# Altium schematic sheet LoraSTM32_2v2.SchDoc
size 420 x 297 mm; Organization: Altium Limited; Address1: L3, 12a Rodborough Rd; Address2: Frenchs Forest; Address3: NSW; Address4: Australia 2086; Scale: 1:1; Разраб.: Иванов; Обозначение документа: АБВГ.123456.001 Э3; Пров.: Петров; Утв.: Сидоров; Наименование организации: ОАО "Ваша фирма"; Перв. применение: АБВГ.123456.000; Наименование изделия 1: Плата; Наименование изделия 2: Схема электрическая; Наименование изделия 3: принципиальная; Нач. отд.: Нач. отд.; Фамилия нач. отд.: Сидоров
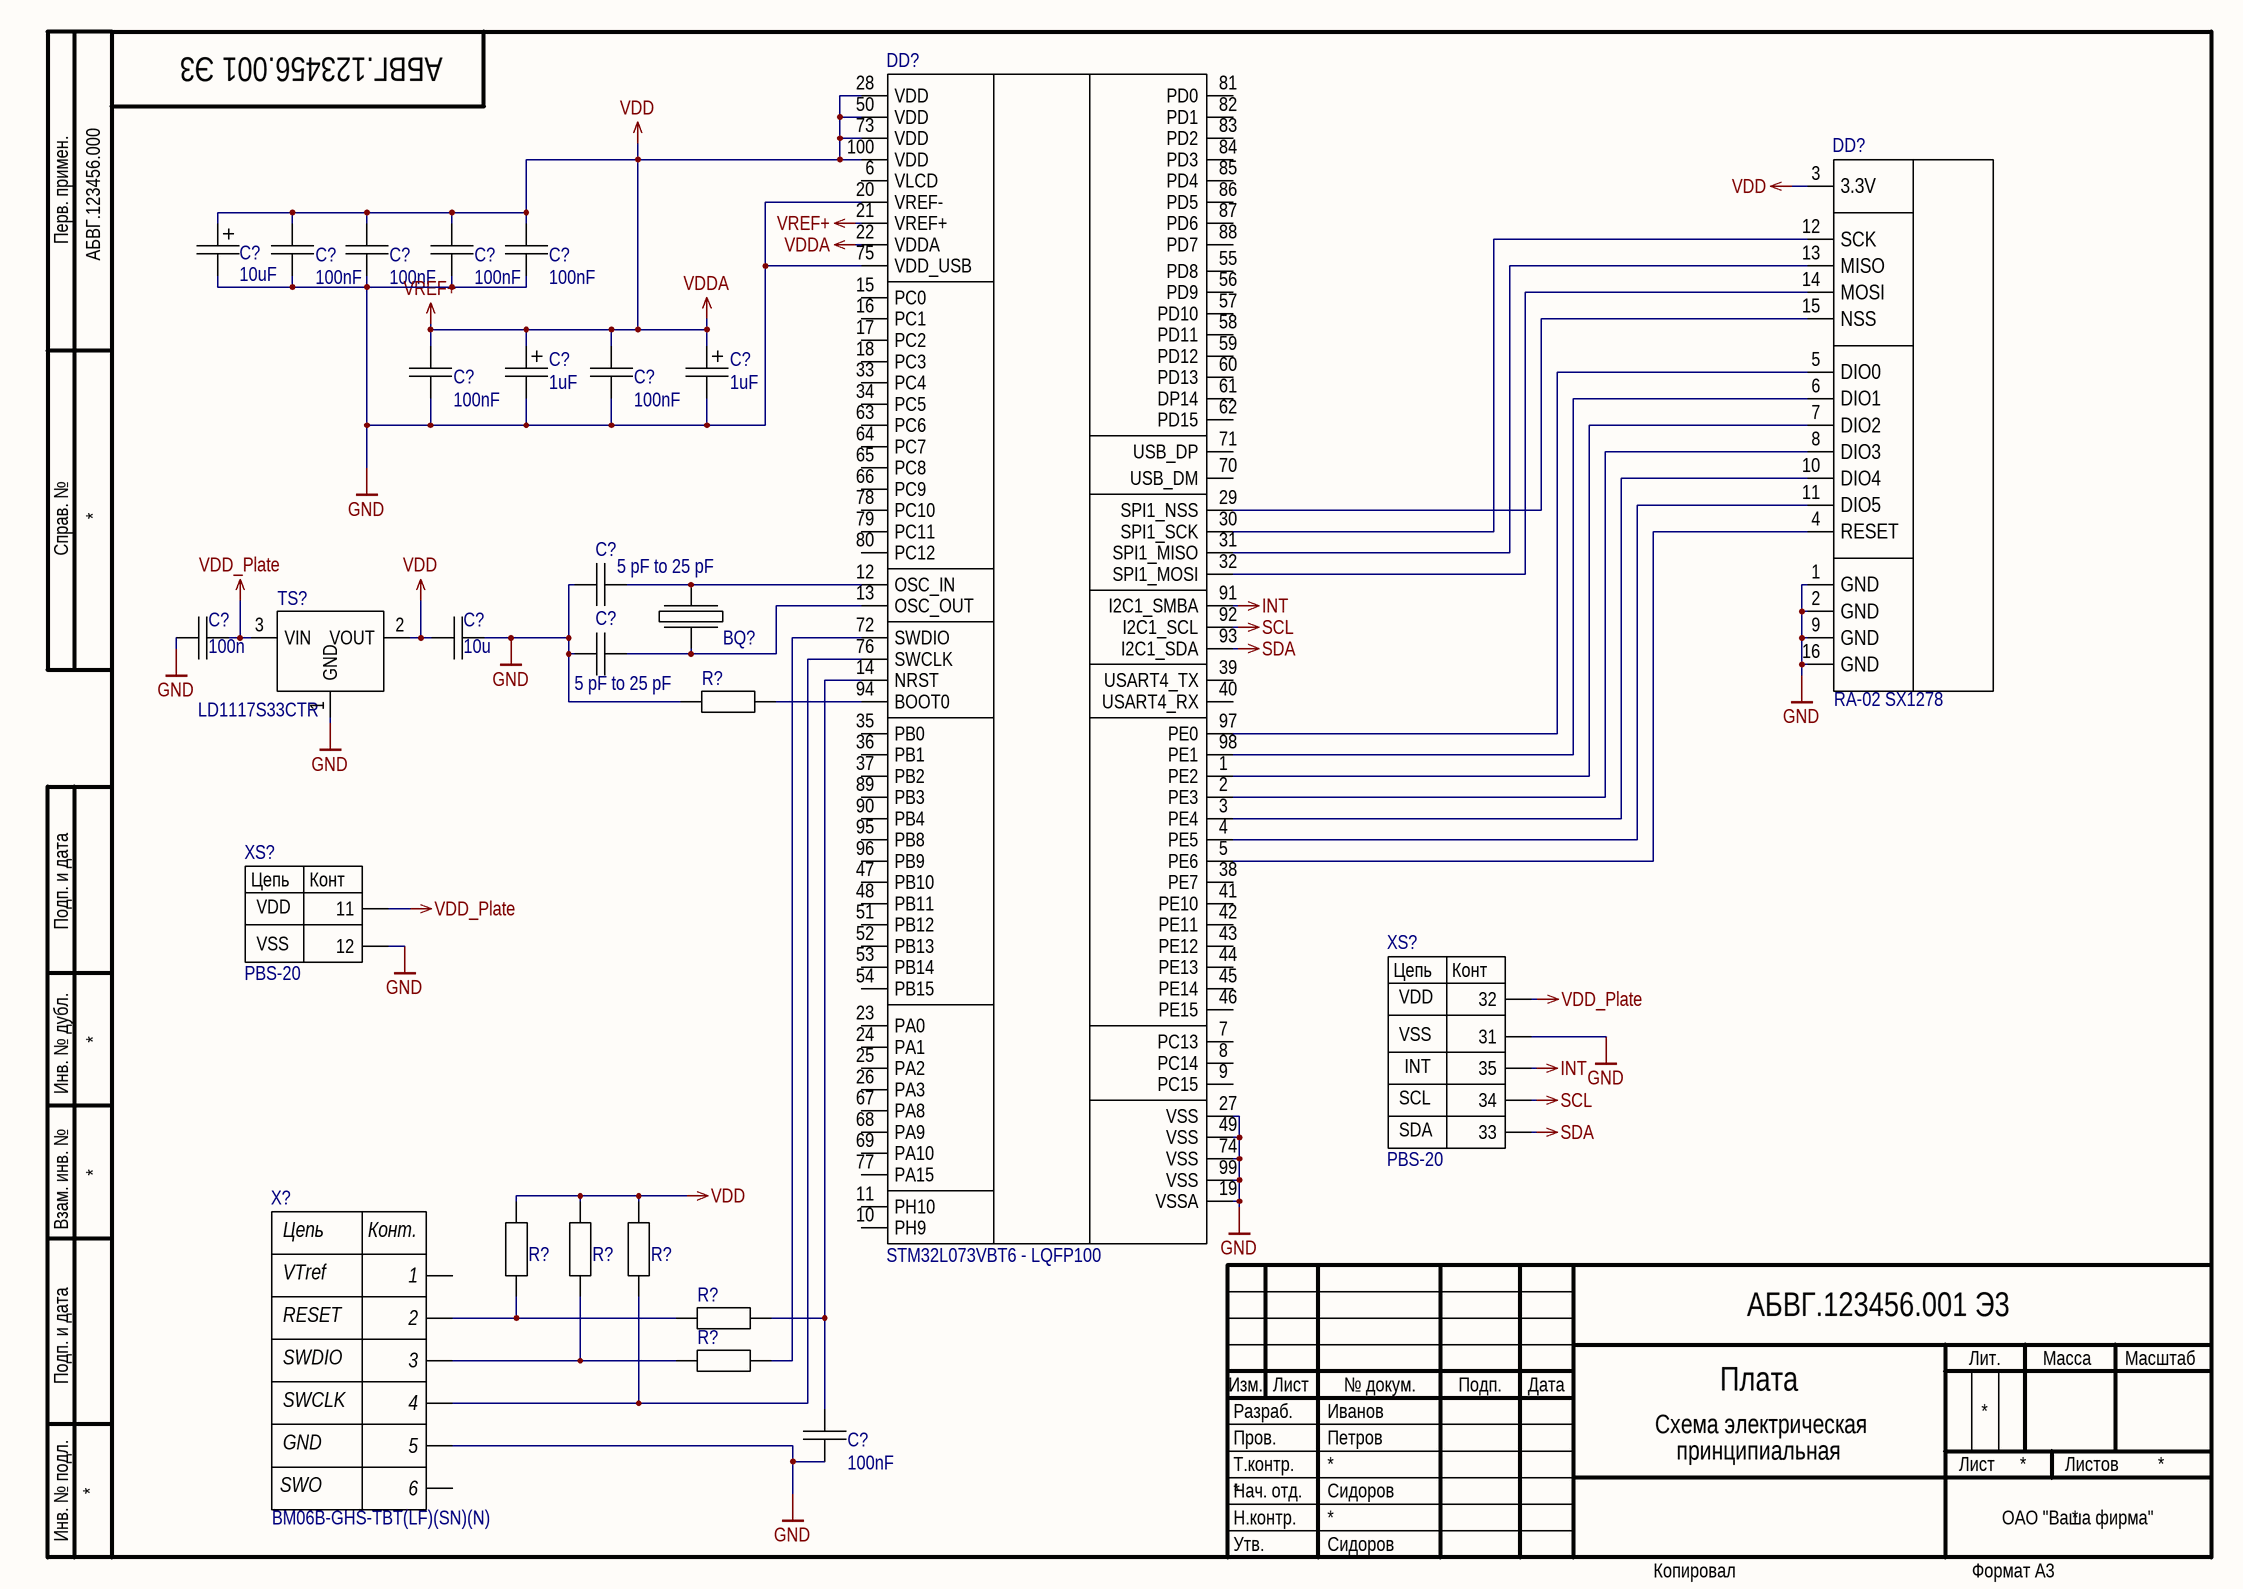
[diagram p0: LoraSTM32_2v2.SchDoc]

## Parts
(Parts that share a designator on the sheet are numbered #1, #2 ... from top to bottom, then left to right.)
BQ?  ABM8G-12.000MHZ-4Y-T3  [ABM8G]  (value not drawn)
C?#1  value 10uF  [CAPMP3216X16N-A]  (hidden comment: *)
C?#2  value 100nF  [CAPC0603X02N]  (hidden comment: CC0603)
C?#3  value 100nF  [CAPC0603X02N]  (hidden comment: CC0603)
C?#4  value 100nF  [CAPC0603X02N]  (hidden comment: CC0603)
C?#5  value 100nF  [CAPC0603X02N]  (hidden comment: CC0603)
C?#6  value 100nF  [CAPC0603X02N]  (hidden comment: CC0603)
C?#7  value 1uF  [CAPMP3216X16N-A]  (hidden comment: *)
C?#8  value 100nF  [CAPC0603X02N]  (hidden comment: CC0603)
C?#9  value 1uF  [CAPMP3216X16N-A]  (hidden comment: *)
C?#10  value 5 pF to 25 pF  [CAPC0603X02N]  (hidden comment: CC0603)
C?#11  GRM21BR71C105KA01L: 100n  [Murata_GRM121_IPC_B]  (hidden comment: *)
C?#12  GRM21BR71C105KA01L: 10u  [Murata_GRM121_IPC_B]  (hidden comment: *)
C?#13  value 5 pF to 25 pF  [CAPC0603X02N]  (hidden comment: CC0603)
C?#14  value 100nF  [CAPC0603X02N]  (hidden comment: CC0603)
DD?#1  STM32L073VBT6 - LQFP100  [*QFP50P1600X1600X170-100N]
DD?#2  RA-02 SX1278  [RA-02]
R?#1  R1608  [RESC1608X05N]  (value not drawn)
R?#2  R1608  [RESC1608X05N]  (value not drawn)
R?#3  R1608  [RESC1608X05N]  (value not drawn)
R?#4  R1608  [RESC1608X05N]  (value not drawn)
R?#5  R1608  [RESC1608X05N]  (value not drawn)
R?#6  R1608  [RESC1608X05N]  (value not drawn)
TS?  LD1117S33CTR  [SOT-23-TT3_M]
X?  BM06B-GHS-TBT(LF)(SN)(N)  [BM06B-GH]
XS?#1  PBS-20  [PBS-20 - 13]
XS?#2  PBS-20  [PBS-20]

## Nets
GND: C?#1.2 C?#2.2 C?#3.2 C?#4.2 C?#5.2 C?#6.2 C?#7.2 C?#8.2 C?#9.2 C?#10.1 C?#11.2 C?#12.1 C?#13.1 C?#14.2 DD?#1.19(VSSA) DD?#1.20(VREF-) DD?#1.27(VSS) DD?#1.49(VSS) DD?#1.74(VSS) DD?#1.75(VDD_USB) DD?#1.99(VSS) DD?#2.1(GND) DD?#2.2(GND) DD?#2.9(GND) DD?#2.16(GND) R?#1.2 TS?.1(GND) X?.5 XS?#1.12 XS?#2.10(31)
INT: DD?#1.91(I2C1_SMBA) XS?#2.6(35)
SCL: DD?#1.92(I2C1_SCL) XS?#2.7(34)
SDA: DD?#1.93(I2C1_SDA) XS?#2.8(33)
VDD: C?#1.1 C?#2.1 C?#3.1 C?#4.1 C?#5.1 C?#6.1 C?#7.1 C?#8.1 C?#9.1 C?#12.2 DD?#1.21(VREF+) DD?#1.22(VDDA) DD?#1.28(VDD) DD?#1.50(VDD) DD?#1.73(VDD) DD?#1.100(VDD) DD?#2.3(3.3V) R?#2.1 R?#3.1 R?#4.1 TS?.2(VOUT)  [also labelled VDDA, VREF+]
VDD_Plate: C?#11.1 TS?.3(VIN) XS?#1.11 XS?#2.9(32)
NetBQ?_1: BQ?.1 C?#13.2 DD?#1.13(OSC_OUT)
NetBQ?_3: BQ?.3 C?#10.2 DD?#1.12(OSC_IN)
NetC?#14_1: C?#14.1 DD?#1.14(NRST) R?#5.1
NetDD?#1_1: DD?#1.1(PE2) DD?#2.7(DIO2)
NetDD?#1_2: DD?#1.2(PE3) DD?#2.8(DIO3)
NetDD?#1_3: DD?#1.3(PE4) DD?#2.10(DIO4)
NetDD?#1_4: DD?#1.4(PE5) DD?#2.11(DIO5)
NetDD?#1_5: DD?#1.5(PE6) DD?#2.4(RESET)
NetDD?#1_29: DD?#1.29(SPI1_NSS) DD?#2.15(NSS)
NetDD?#1_30: DD?#1.30(SPI1_SCK) DD?#2.12(SCK)
NetDD?#1_31: DD?#1.31(SPI1_MISO) DD?#2.13(MISO)
NetDD?#1_32: DD?#1.32(SPI1_MOSI) DD?#2.14(MOSI)
NetDD?#1_72: DD?#1.72(SWDIO) R?#6.1
NetDD?#1_76: DD?#1.76(SWCLK) R?#4.2 X?.4
NetDD?#1_94: DD?#1.94(BOOT0) R?#1.1
NetDD?#1_97: DD?#1.97(PE0) DD?#2.5(DIO0)
NetDD?#1_98: DD?#1.98(PE1) DD?#2.6(DIO1)
NetR?#2_2: R?#2.2 R?#5.2 X?.2
NetR?#3_2: R?#3.2 R?#6.2 X?.3

Not connected (* = marked no-connect by the designer): DD?#1 6(VLCD) 7(PC13) 8(PC14) 9(PC15) 10(PH9) 11(PH10) 15(PC0) 16(PC1) 17(PC2) 18(PC3) 23(PA0) 24(PA1) 25(PA2) 26(PA3) 33(PC4) 34(PC5) 35(PB0) 36(PB1) 37(PB2) 38(PE7) 39(USART4_TX) 40(USART4_RX) 41(PE10) 42(PE11) 43(PE12) 44(PE13) 45(PE14) 46(PE15) 47(PB10) 48(PB11) 51(PB12) 52(PB13) 53(PB14) 54(PB15) 55(PD8) 56(PD9) 57(PD10) 58(PD11) 59(PD12) 60(PD13) 61(DP14) 62(PD15) 63(PC6) 64(PC7) 65(PC8) 66(PC9) 67(PA8) 68(PA9) 69(PA10) 70(USB_DM) 71(USB_DP) 77(PA15) 78(PC10) 79(PC11) 80(PC12) 81(PD0) 82(PD1) 83(PD2) 84(PD3) 85(PD4) 86(PD5) 87(PD6) 88(PD7) 89(PB3) 90(PB4) 95(PB8) 96(PB9); X? 1 6

## Notes on the sheet
- Перв. примен.
- Справ. №
- Подп. и дата
- Инв. № дубл.
- Взам. инв. №
- Разраб.
- Изм.
- Лист
- № докум.
- Подп.
- Дата
- Лит.
- Масса
- Масштаб
- Пров.
- Т.контр.
- Листов
- Инв. № подл.
- Утв.
- Н.контр.
- Копировал
- Формат А3
- (in symbol PBS-20_1) Цепь; Конт; VDD; VSS
- (in symbol PBS_20_2) Цепь; Конт; VDD; VSS; INT; SCL; SDA
- (in symbol Разъем SWD) Цепь; Конт.; VTref; RESET; SWDIO; SWCLK; GND; SWO

## Library data of the parts
BQ? = ABM8G-12.000MHZ-4Y-T3: 12MHz ±30ppm Crystal 10pF 120 Ohm -10°C ~ 60°C  Surface Mount 4-SMD, No Lead (DFN, LCC); Manufacturer: Abracon; ESR (Equivalent Series Resistance): 120R; Supplier 1: Digi-Key; Manufacturer Part Number: ABM8G-12.000MHZ-4Y-T3; Stock 1: 100422; Pricing 1: 1=0.45, 10=0.371, 50=0.3342, 100=0.297, 500=0.28216, 1000=0.2376 (USD); Mount: Surface Mount; Case/Package: CSMD; Number of Pins: 4; Min Operating Temperature: -10°C; Max Operating Temperature: 60°C; Frequency: 12MHz; Load Capacitance: 10pF; Packaging: Tape and Reel; Frequency Tolerance: 30ppm; Frequency Stability: 30ppm; Series Resistance: 120R; Length: 3.2mm; Height: 0.039inch; Width: 0.098inch; Depth: 2.5mm; REACH SVHC: No SVHC; Lead Free: Lead Free; ComponentLink1URL: https://www.verical.com/server-webapp/html/getDatasheet?partID=719872; ComponentLink1Description: https://www.verical.com/server-webapp/html/getDatasheet?partID=719872; ComponentLink2URL: https://abracon.com/Resonators/ABM8G.pdf; ComponentLink2Description: https://abracon.com/Resonators/ABM8G.pdf; ComponentLink3URL: http://www.abracon.com/Resonators/ABM8G.pdf; ComponentLink3Description: http://www.abracon.com/Resonators/ABM8G.pdf; Supplier Part Number 1: 535-10901-1-ND
C?#1 C?#7 C?#9 = CT3216-A: Tantalum Surface Mount Capacitor, Size A; Voltage: 6.3V; Type: *; PartNo: *; Supplier Part Number 1: *; Supplier 1: *
C?#2-C?#6 C?#8 C?#10 C?#13 C?#14 = CC0603: Конденсатор 0.6х0.3 мм; Voltage: *; Type: *; PartNo: *; Supplier Part Number 1: *; Supplier 1: *; РКД Наименование: *
C?#11 C?#12 = CC1608: Конденсатор 1.6x0.8 мм; Tolerance: ±10%; ТКЕ: X7R; РКД Наименование: CC1608M - NP0 - 16 V - 10 nF ±10%; Voltage: *; Type: *; PartNo: *; Supplier Part Number 1: *; Supplier 1: *
DD?#1 = STM32L073VBT6: Ultra-low-power 32-bit MCU Arm®-based Cortex®-M0+, up to 192KB / Flash, 20KB SRAM, 6KB EEPROM, LCD, USB, ADC, DACs; ComponentLink1Description: datasheet; ComponentLink1URL: https://www.farnell.com/datasheets/2819148.pdf; ComponentLink2Description: buy; ComponentLink2URL: https://www.chipdip.ru/product/stm32l073vbt6
DD?#2 = RA-02
R?#1 R?#5 R?#6 = R1608: Резистор 1.6x0.8 мм; Tolerance: ±1%; РКД Наименование: RC1608M - 22 Ohm ±1%; Value: 22; Type: *; PartNo: *; Supplier 1: *; Supplier Part Number 1: *
R?#2-R?#4 = R1608: Резистор 1.6x0.8 мм; Tolerance: ±1%; РКД Наименование: RC1608M - 22 Ohm ±1%; Value: 10k; Type: *; PartNo: *; Supplier 1: *; Supplier Part Number 1: *
TS? = MCP1700T-3302E/TT: Low Quiescent Current LDO, 3-Pin SOT-23, Extended Temperature, Tape and Reel; Code_IPC: SOT23-3; PackageVersion: revBB, Aug-2009; PackageReference: SOT-23-TT3; PackageDescription: 3-Lead Plastic Small Outline Transistor (TT) [SOT-23]; DatasheetVersion: revB, Feb-2007; PartNumber: MCP1700T-3302E/TT
X? = Разъем SWD: SWD отладка; Manufacturer: JST; Max Current Rating: 1A; Contact Resistance: 50mR; Number of Positions: 6; Max Voltage Rating (AC): 50V; Connector Type: Outer Shroud Contact; Pitch: 0.049inch; PartNo: BM06B-GHS-TBT(LF)(SN)(N); Supplier 1: Digi-Key; Supplier Part Number 1: 455-1582-1-ND; Manufacturer Part Number: BM06B-GHS-TBT(LF)(SN)(N); Stock 1: 44065; Pricing 1: 1=0.56, 10=0.524, 100=0.4019, 500=0.34948, 1000=0.28832 (USD); Mount: Surface Mount; Colour: Natural; Contact Plating: Copper,Tin; Contact Material: Bronze; Housing Colour: Beige; Housing Material: Polyamide; Min Operating Temperature: -25°C; Max Operating Temperature: 85°C; Number of Rows: 1; Fastening Type: Ramp; Packaging: Tape and Reel; Termination: Solder; Orientation: Straight; Length: 10.75mm; Depth: 4.25mm; Lead Free: Lead Free; ComponentLink1URL: http://www.jst-mfg.com/product/pdf/eng/eGH.pdf; ComponentLink1Description: http://www.jst-mfg.com/product/pdf/eng/eGH.pdf
XS?#1 = PBS-20_1: ComponentLink1Description: datasheet; ComponentLink1URL: https://static.chipdip.ru/lib/226/DOC000226931.pdf; ComponentLink2Description: buy; ComponentLink2URL: https://www.chipdip.ru/catalog-show/pin-connectors-and-sockets?x.698=ZGQ&gq=PBS
XS?#2 = PBS_20_2